# Altium schematic sheet 01- Revision and Contents.SchDoc: Revision and Contents
size 420 x 297 mm; DocumentNumber: 1; Revision: 1.0; SheetNumber: 1; SheetTotal: 13; Project: LOW LEVEL ECU
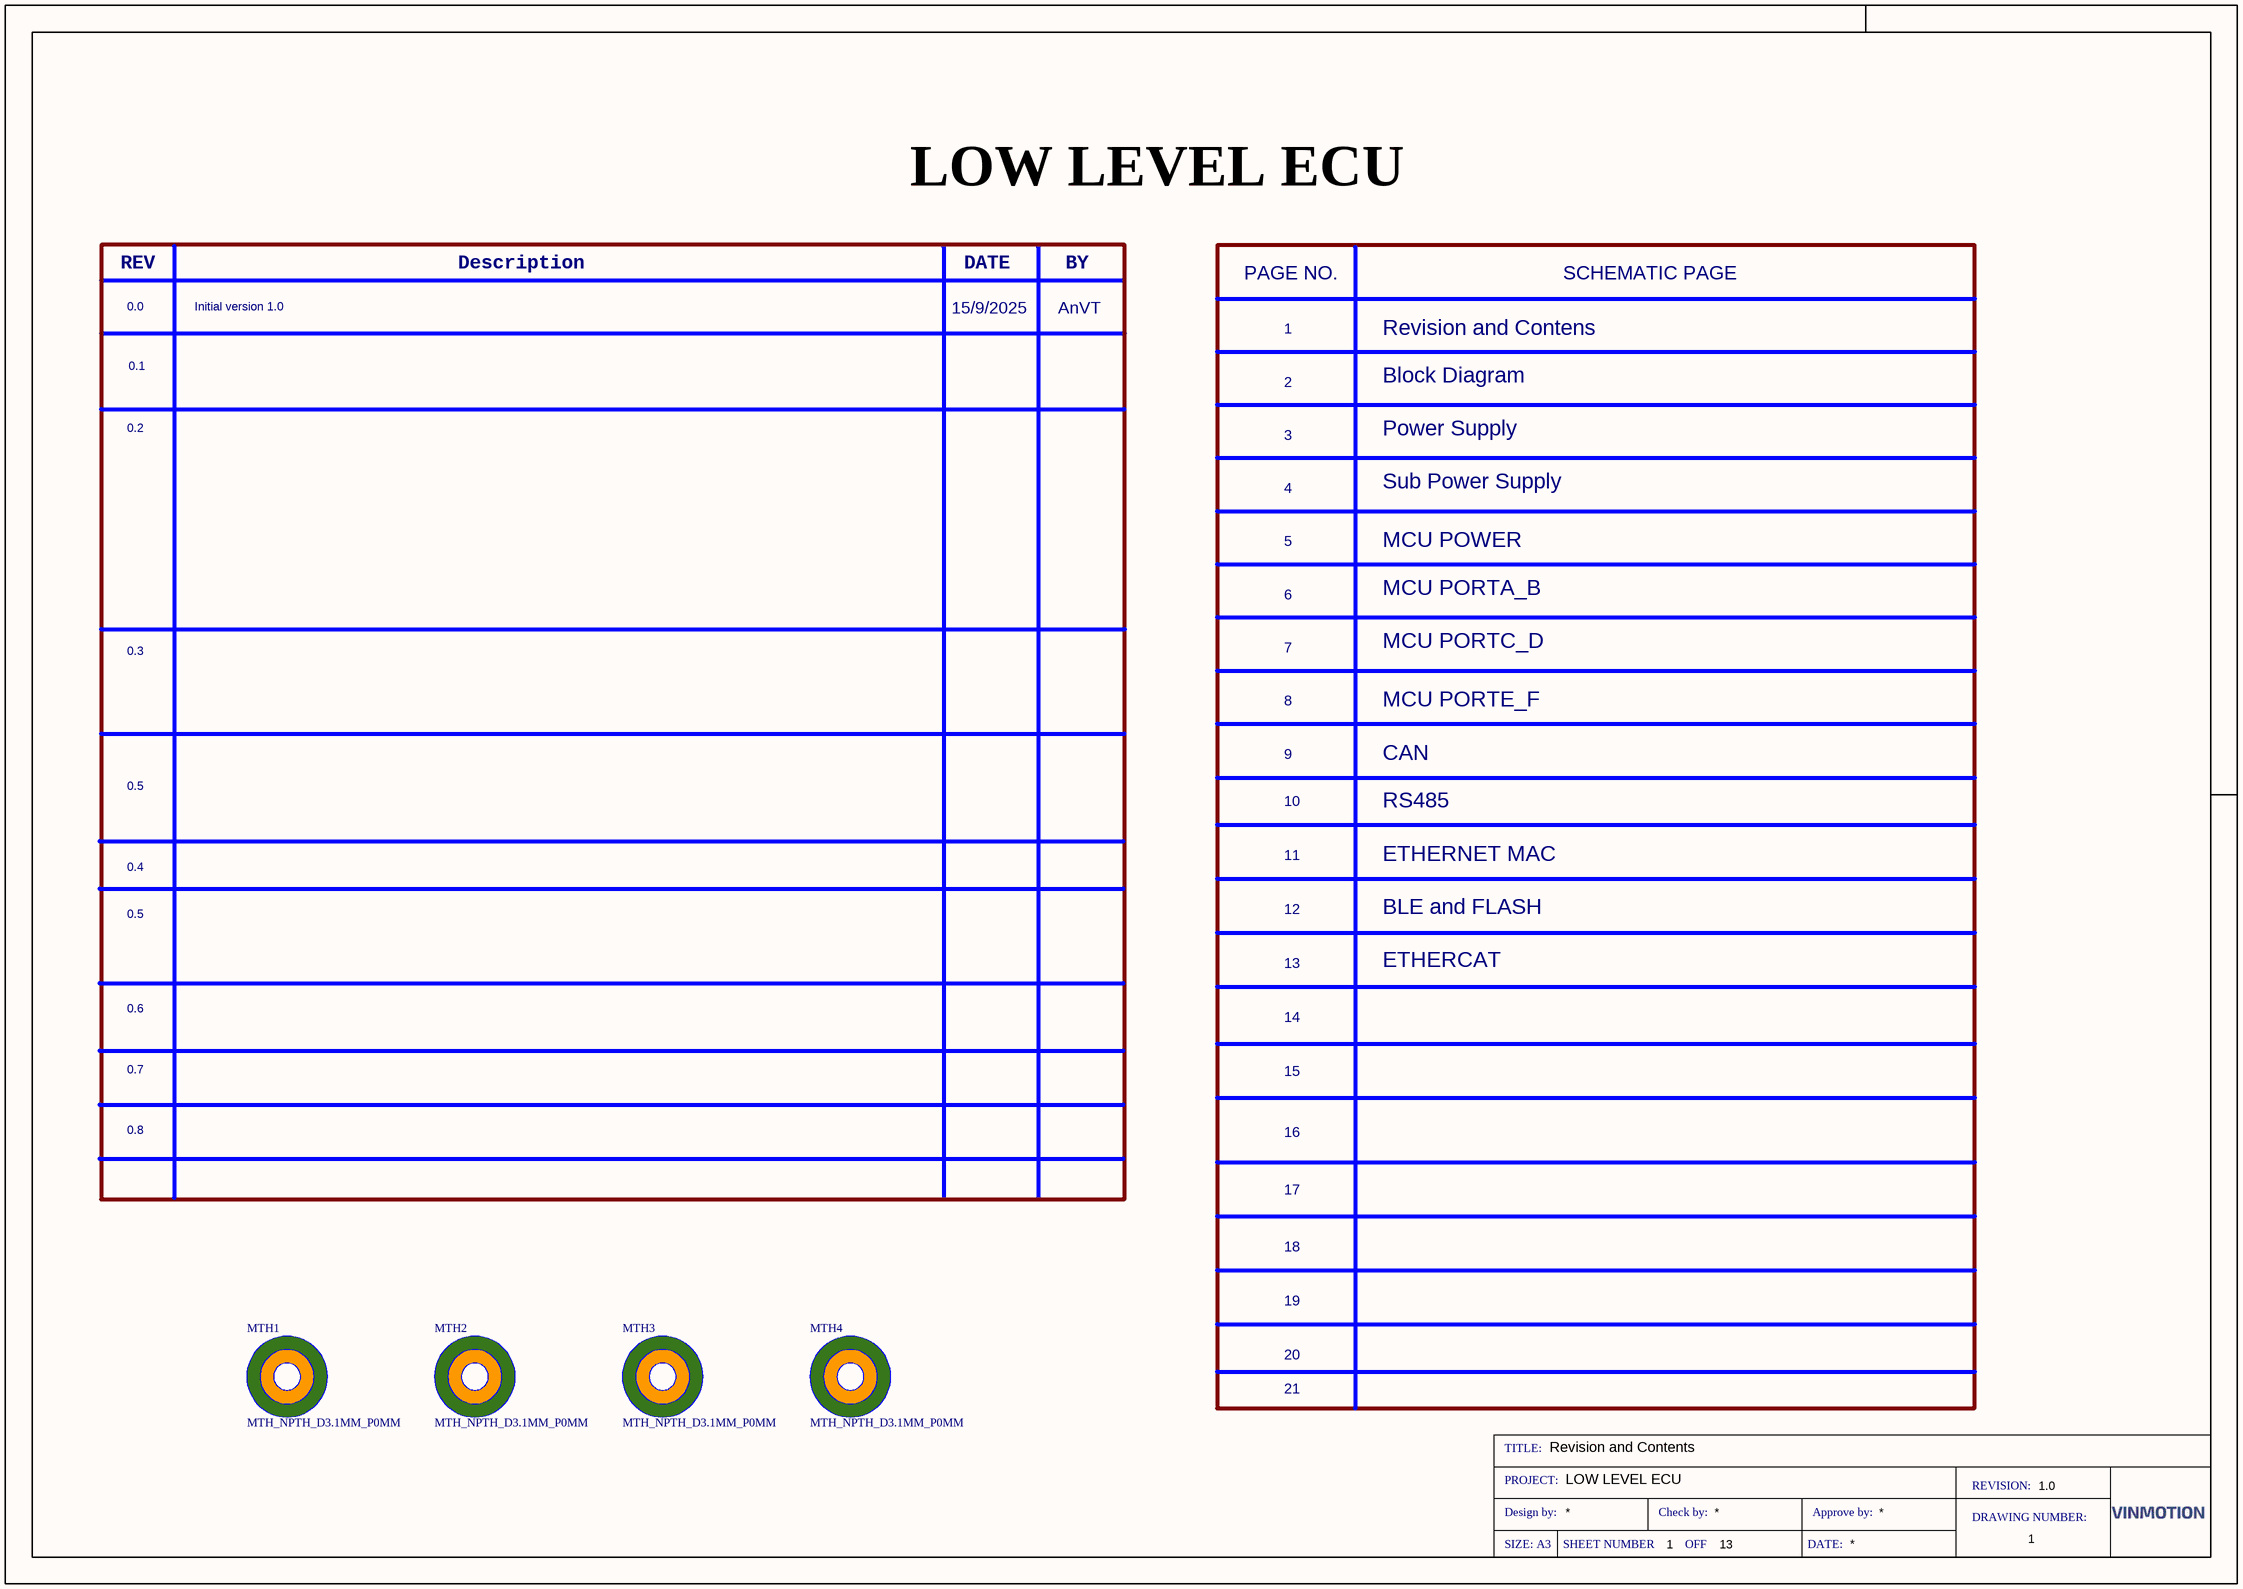
[diagram p0: 01- Revision and Contents.SchDoc]

## Parts
MTH1  MTH_NPTH_D3.1MM_P0MM  [MTH_NPTH_3.1MM]  (no BOM)
MTH2  MTH_NPTH_D3.1MM_P0MM  [MTH_NPTH_3.1MM]  (no BOM)
MTH3  MTH_NPTH_D3.1MM_P0MM  [MTH_NPTH_3.1MM]  (no BOM)
MTH4  MTH_NPTH_D3.1MM_P0MM  [MTH_NPTH_3.1MM]  (no BOM)

## Nets

Not connected (* = marked no-connect by the designer): MTH1 1; MTH2 1; MTH3 1; MTH4 1

## Notes on the sheet
- LOW LEVEL ECU
- REV
- 0.0
- Initial version 1.0
- Description
- 15/9/2025
- DATE
- AnVT
- BY
- PAGE NO.
- SCHEMATIC PAGE
- 0.1
- 1
- 2
- Revision and Contens
- Block Diagram
- 0.2
- 3
- Power Supply
- 4
- Sub Power Supply
- 5
- 6
- MCU POWER
- MCU PORTA_B
- 0.3
- 7
- MCU PORTC_D
- 8
- MCU PORTE_F
- 0.5
- 9
- CAN
- 10
- 11
- RS485
- ETHERNET MAC
- 0.4
- 12
- BLE and FLASH
- 13
- ETHERCAT
- 0.6
- 0.7
- 14
- 0.8
- 15
- 16
- 17
- 18
- 19
- 20
- 21
- TITLE:
- PROJECT:
- Design by:
- Check by:
- Approve by:
- DRAWING NUMBER:
- REVISION:
- SIZE: A3
- SHEET NUMBER
- OFF
- DATE:

## Library data of the parts
MTH1-MTH4 = CMP-00097-4: Mounting hole NPTH Drill 3.1mm, pad size 0mm; Mount Type(SMD/TH): TH; Crossable(YES/NO): NO; Manufacturer 1: N/A; Manufacturer Part Number 1: N/A